# Altium schematic sheet main.SchDoc
size A3; SheetNumber: 1; SheetTotal: 4
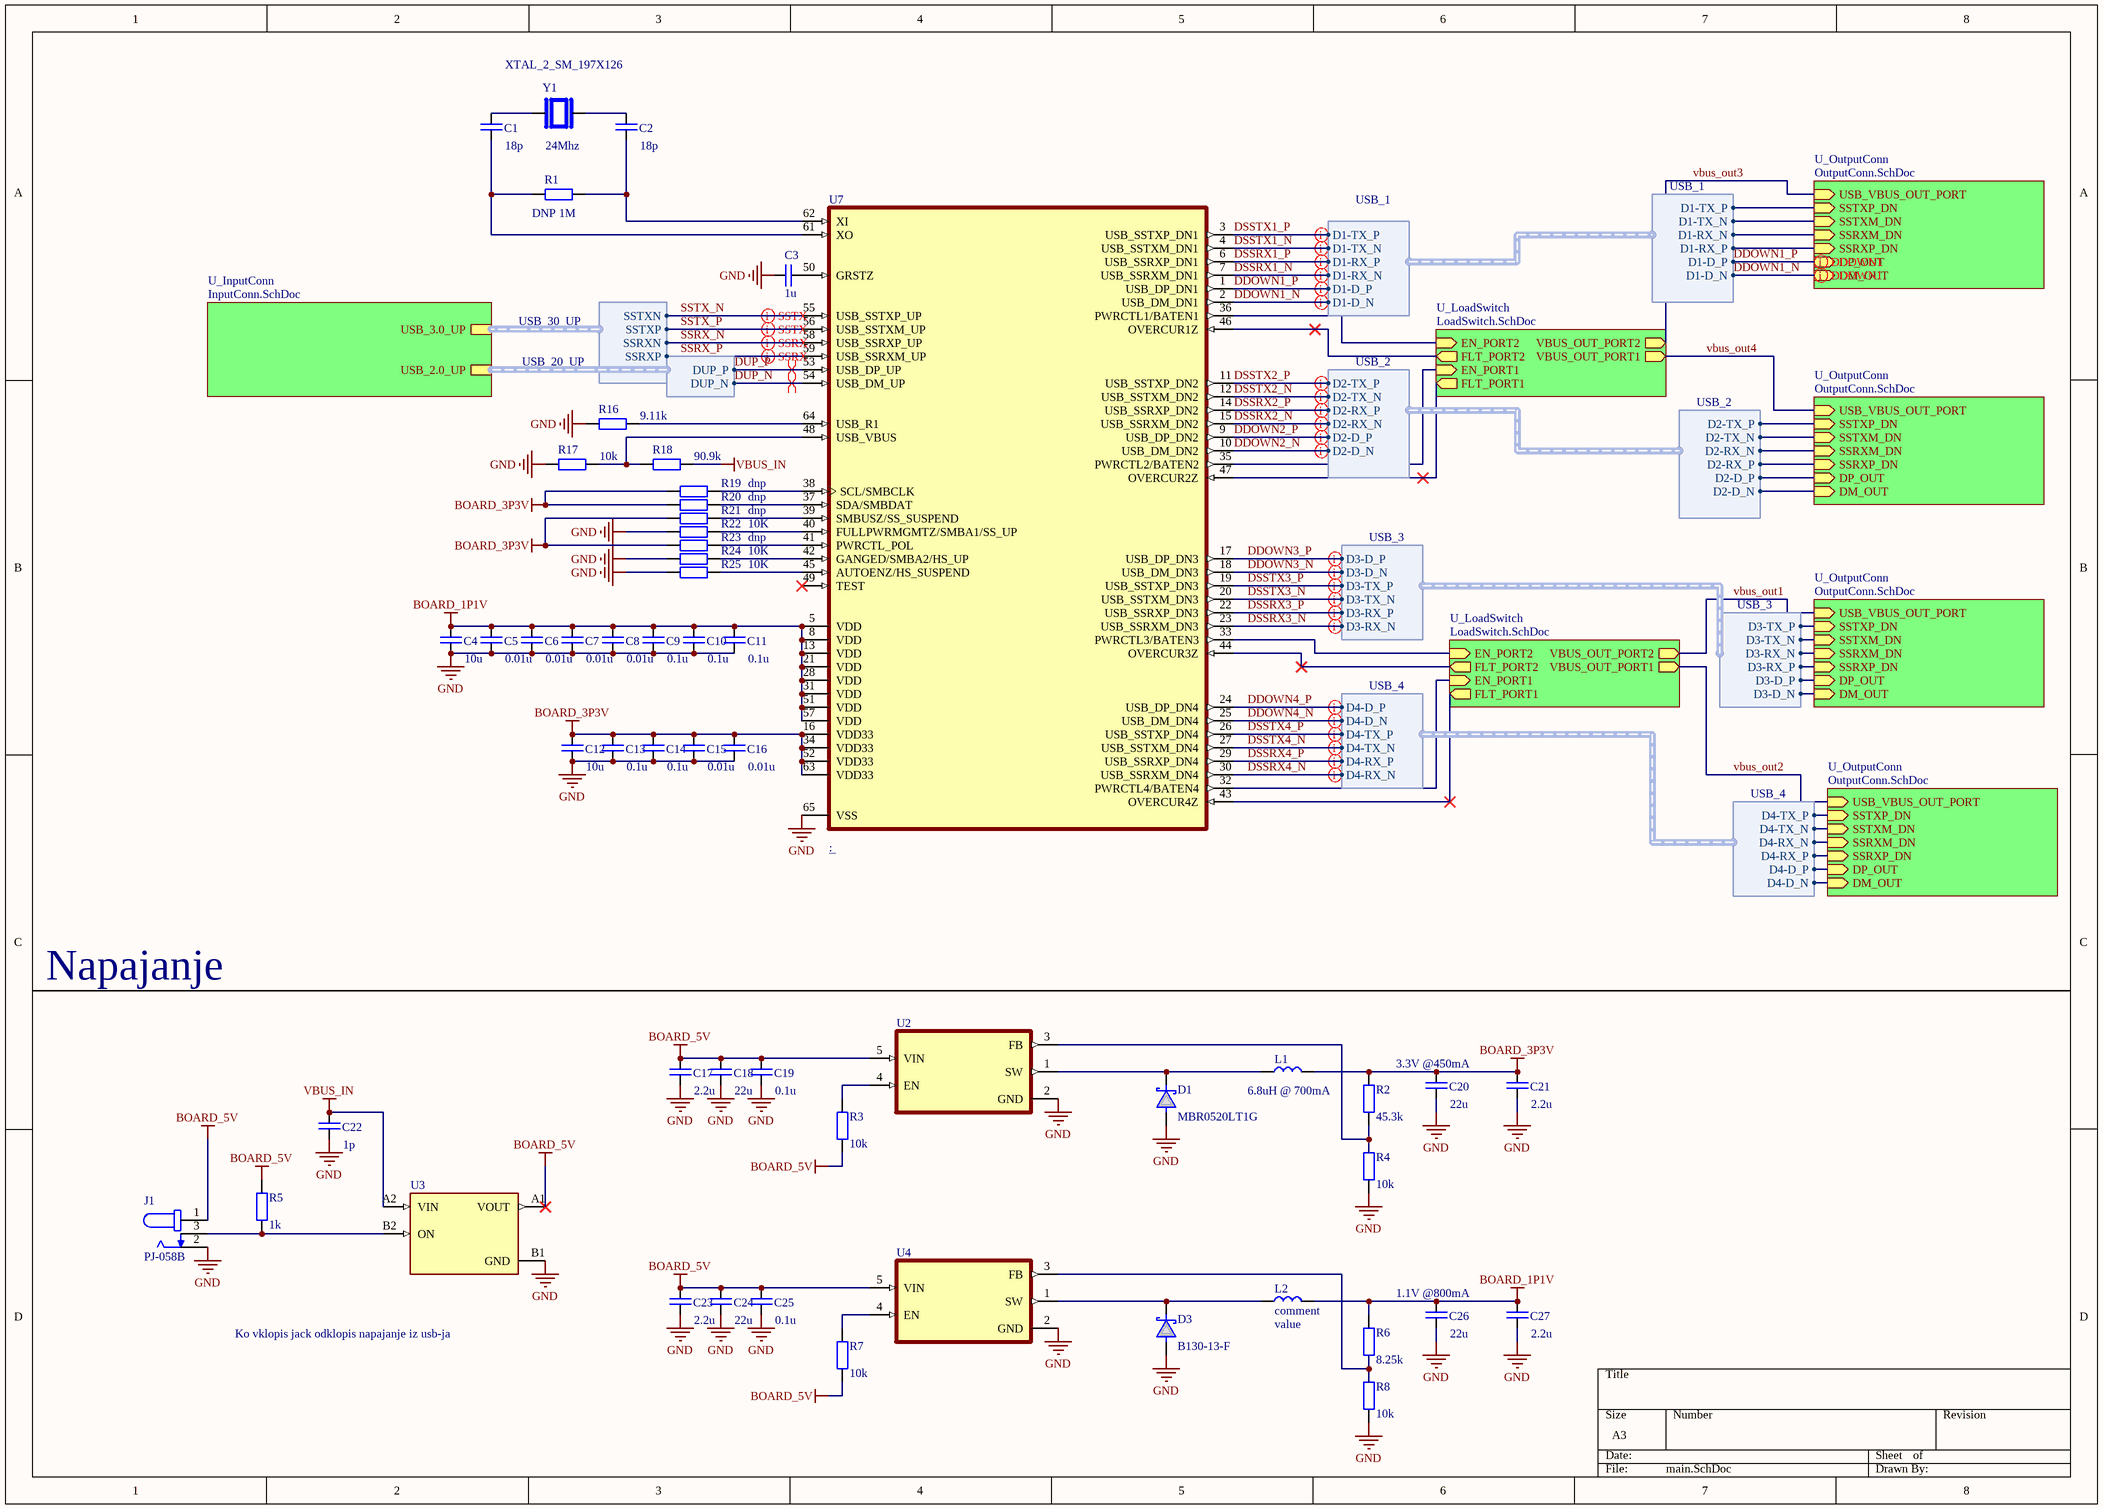
[diagram p0: main.SchDoc]

## Parts
C1  value 18p  [CAP_0603_N]  (hidden comment: comment)
C2  value 18p  [CAP_0603_N]  (hidden comment: comment)
C3  value 1u  [CAP_0603_N]  (hidden comment: comment)
C4  value 10u  [CAP_0603_N]  (hidden comment: comment)
C5  value 0.01u  [CAP_0603_N]  (hidden comment: comment)
C6  value 0.01u  [CAP_0603_N]  (hidden comment: comment)
C7  value 0.01u  [CAP_0603_N]  (hidden comment: comment)
C8  value 0.01u  [CAP_0603_N]  (hidden comment: comment)
C9  value 0.1u  [CAP_0603_N]  (hidden comment: comment)
C10  value 0.1u  [CAP_0603_N]  (hidden comment: comment)
C11  value 0.1u  [CAP_0603_N]  (hidden comment: comment)
C12  value 10u  [CAP_0603_N]  (hidden comment: comment)
C13  value 0.1u  [CAP_0603_N]  (hidden comment: comment)
C14  value 0.1u  [CAP_0603_N]  (hidden comment: comment)
C15  value 0.01u  [CAP_0603_N]  (hidden comment: comment)
C16  value 0.01u  [CAP_0603_N]  (hidden comment: comment)
C17  value 2.2u  [CAP_0603_N]  (hidden comment: comment)
C18  value 22u  [CAP_0603_N]  (hidden comment: comment)
C19  value 0.1u  [CAP_0603_N]  (hidden comment: comment)
C20  value 22u  [CAP_0603_N]  (hidden comment: comment)
C21  value 2.2u  [CAP_0603_N]  (hidden comment: comment)
C22  value 1p  [CAP_0603_N]  (hidden comment: comment)
C23  value 2.2u  [CAP_0603_N]  (hidden comment: comment)
C24  value 22u  [CAP_0603_N]  (hidden comment: comment)
C25  value 0.1u  [CAP_0603_N]  (hidden comment: comment)
C26  value 22u  [CAP_0603_N]  (hidden comment: comment)
C27  value 2.2u  [CAP_0603_N]  (hidden comment: comment)
D1  value MBR0520LT1G  [SOD-123_N]  (hidden comment: comment)
D3  value B130-13-F  [SOD-123_N]  (hidden comment: comment)
J1  PJ-058B  [CUI_PJ-058B]
L1  value 6.8uH @ 700mA  [SMD_1206_N]  (hidden comment: comment)
L2  comment  [SMD_0603_N]
R1  DNP  value 1M  [SMD_0603_N]
R2  value 45.3k  [SMD_0603_N]  (hidden comment: comment)
R3  value 10k  [SMD_0603_N]  (hidden comment: comment)
R4  value 10k  [SMD_0603_N]  (hidden comment: comment)
R5  value 1k  [SMD_0603_N]  (hidden comment: comment)
R6  value 8.25k  [SMD_0603_N]  (hidden comment: comment)
R7  value 10k  [SMD_0603_N]  (hidden comment: comment)
R8  value 10k  [SMD_0603_N]  (hidden comment: comment)
R16  value 9.11k  [SMD_0603_N]  (hidden comment: DNP)
R17  value 10k  [SMD_0603_N]  (hidden comment: DNP)
R18  value 90.9k  [SMD_0603_N]  (hidden comment: DNP)
R19  DNP  [SMD_0603_N]
R20  DNP  [SMD_0603_N]
R21  DNP  [SMD_0603_N]
R22  value 10K  [SMD_0603_N]  (hidden comment: DNP)
R23  DNP  [SMD_0603_N]
R24  value 10K  [SMD_0603_N]  (hidden comment: DNP)
R25  value 10K  [SMD_0603_N]  (hidden comment: DNP)
U2  (no value)  [SOT95P280X145-5N]
U3  (no value)  [BGA4N50P2X2_88X88X50N]
U4  (no value)  [SOT95P280X145-5N]
U7  (no value)  [QFN50P900X900X100-65N]
Y1  XTAL_2_SM_197X126  value 24Mhz  [XTAL_CC7V-T1A-32.768KHZ-12.5PF-100PPM-TA-QC]

## Sub-sheets
U_InputConn = InputConn.SchDoc: USB_2.0_UP (harness USB_20_UP), USB_3.0_UP (harness USB_30_UP)
U_LoadSwitch = LoadSwitch.SchDoc: EN_PORT2 (in), EN_PORT1 (in), VBUS_OUT_PORT2 (out), VBUS_OUT_PORT1 (out), FLT_PORT2 (out), FLT_PORT1 (out)
U_LoadSwitch = LoadSwitch.SchDoc: EN_PORT2 (in), EN_PORT1 (in), VBUS_OUT_PORT2 (out), VBUS_OUT_PORT1 (out), FLT_PORT2 (out), FLT_PORT1 (out)
U_OutputConn = OutputConn.SchDoc: USB_VBUS_OUT_PORT (in), SSTXP_DN (in), SSTXM_DN (in), SSRXM_DN (in), SSRXP_DN (in), DP_OUT (in), DM_OUT (in)
U_OutputConn = OutputConn.SchDoc: USB_VBUS_OUT_PORT (in), SSTXP_DN (in), SSTXM_DN (in), SSRXM_DN (in), SSRXP_DN (in), DP_OUT (in), DM_OUT (in)
U_OutputConn = OutputConn.SchDoc: USB_VBUS_OUT_PORT (in), SSTXP_DN (in), SSTXM_DN (in), SSRXM_DN (in), SSRXP_DN (in), DP_OUT (in), DM_OUT (in)
U_OutputConn = OutputConn.SchDoc: USB_VBUS_OUT_PORT (in), SSTXP_DN (in), SSTXM_DN (in), SSRXM_DN (in), SSRXP_DN (in), DP_OUT (in), DM_OUT (in)

## Harnesses
USB_20_UP: DUP_N, DUP_P
USB_30_UP: SSRXN, SSRXP, SSTXN, SSTXP
USB_1: D1-D_P, D1-D_N, D1-RX_P, D1-RX_N, D1-TX_P, D1-TX_N
USB_2: D2-D_P, D2-D_N, D2-RX_P, D2-RX_N, D2-TX_P, D2-TX_N
USB_3: D3-D_P, D3-D_N, D3-RX_P, D3-RX_N, D3-TX_P, D3-TX_N
USB_4: D4-D_P, D4-D_N, D4-RX_P, D4-RX_N, D4-TX_P, D4-TX_N

## Nets
BOARD_1P1V: C4.1 C5.1 C6.1 C7.1 C8.1 C9.1 C10.1 C11.1 C26.1 C27.1 L2.2 R6.1 U7.5(VDD) U7.8(VDD) U7.13(VDD) U7.21(VDD) U7.28(VDD) U7.31(VDD) U7.51(VDD) U7.57(VDD)
BOARD_3P3V: C12.1 C13.1 C14.1 C15.1 C16.1 C20.1 C21.1 L1.2 R2.1 R19.1 R20.1 R21.1 R23.1 U7.16(VDD33) U7.34(VDD33) U7.52(VDD33) U7.63(VDD33)
BOARD_5V: C17.1 C18.1 C19.1 C23.1 C24.1 C25.1 J1.1 R3.2 R5.1 R7.2 U2.5(VIN) U3.A1(VOUT) U4.5(VIN)
GND: C3.1 C4.2 C5.2 C6.2 C7.2 C8.2 C9.2 C10.2 C11.2 C12.2 C13.2 C14.2 C15.2 C16.2 C17.2 C18.2 C19.2 C20.2 C21.2 C22.2 C23.2 C24.2 C25.2 C26.2 C27.2 D1.A D3.A J1.2 R4.2 R8.2 R16.1 R17.1 R22.1 R24.1 R25.1 U2.2(GND) U3.B1(GND) U4.2(GND) U7.65(VSS)
VBUS_IN: C22.1 R18.2 U3.A2(VIN)
DDOWN1_N: U7.2(USB_DM_DN1) ; sheet U_OutputConn/DM_OUT, harness USB_1.D1-D_N
DDOWN1_P: U7.1(USB_DP_DN1) ; sheet U_OutputConn/DP_OUT, harness USB_1.D1-D_P
DDOWN2_N: U7.10(USB_DM_DN2) ; sheet U_OutputConn/DM_OUT, harness USB_2.D2-D_N
DDOWN2_P: U7.9(USB_DP_DN2) ; sheet U_OutputConn/DP_OUT, harness USB_2.D2-D_P
DDOWN3_N: U7.18(USB_DM_DN3) ; sheet U_OutputConn/DM_OUT, harness USB_3.D3-D_N
DDOWN3_P: U7.17(USB_DP_DN3) ; sheet U_OutputConn/DP_OUT, harness USB_3.D3-D_P
DDOWN4_N: U7.25(USB_DM_DN4) ; sheet U_OutputConn/DM_OUT, harness USB_4.D4-D_N
DDOWN4_P: U7.24(USB_DP_DN4) ; sheet U_OutputConn/DP_OUT, harness USB_4.D4-D_P
DSSRX1_N: U7.7(USB_SSRXM_DN1) ; sheet U_OutputConn/SSRXM_DN, harness USB_1.D1-RX_N
DSSRX1_P: U7.6(USB_SSRXP_DN1) ; sheet U_OutputConn/SSRXP_DN, harness USB_1.D1-RX_P
DSSRX2_N: U7.15(USB_SSRXM_DN2) ; sheet U_OutputConn/SSRXM_DN, harness USB_2.D2-RX_N
DSSRX2_P: U7.14(USB_SSRXP_DN2) ; sheet U_OutputConn/SSRXP_DN, harness USB_2.D2-RX_P
DSSRX3_N: U7.23(USB_SSRXM_DN3) ; sheet U_OutputConn/SSRXM_DN, harness USB_3.D3-RX_N
DSSRX3_P: U7.22(USB_SSRXP_DN3) ; sheet U_OutputConn/SSRXP_DN, harness USB_3.D3-RX_P
DSSRX4_N: U7.30(USB_SSRXM_DN4) ; sheet U_OutputConn/SSRXM_DN, harness USB_4.D4-RX_N
DSSRX4_P: U7.29(USB_SSRXP_DN4) ; sheet U_OutputConn/SSRXP_DN, harness USB_4.D4-RX_P
DSSTX1_N: U7.4(USB_SSTXM_DN1) ; sheet U_OutputConn/SSTXM_DN, harness USB_1.D1-TX_N
DSSTX1_P: U7.3(USB_SSTXP_DN1) ; sheet U_OutputConn/SSTXP_DN, harness USB_1.D1-TX_P
DSSTX2_N: U7.12(USB_SSTXM_DN2) ; sheet U_OutputConn/SSTXM_DN, harness USB_2.D2-TX_N
DSSTX2_P: U7.11(USB_SSTXP_DN2) ; sheet U_OutputConn/SSTXP_DN, harness USB_2.D2-TX_P
DSSTX3_N: U7.20(USB_SSTXM_DN3) ; sheet U_OutputConn/SSTXM_DN, harness USB_3.D3-TX_N
DSSTX3_P: U7.19(USB_SSTXP_DN3) ; sheet U_OutputConn/SSTXP_DN, harness USB_3.D3-TX_P
DSSTX4_N: U7.27(USB_SSTXM_DN4) ; sheet U_OutputConn/SSTXM_DN, harness USB_4.D4-TX_N
DSSTX4_P: U7.26(USB_SSTXP_DN4) ; sheet U_OutputConn/SSTXP_DN, harness USB_4.D4-TX_P
DUP_N: U7.54(USB_DM_UP) ; sheet U_InputConn/USB_2.0_UP.DUP_N
DUP_P: U7.53(USB_DP_UP) ; sheet U_InputConn/USB_2.0_UP.DUP_P
SSRX_N: U7.58(USB_SSRXP_UP) ; sheet U_InputConn/USB_3.0_UP.SSRXN
SSRX_P: U7.59(USB_SSRXM_UP) ; sheet U_InputConn/USB_3.0_UP.SSRXP
SSTX_N: U7.55(USB_SSTXP_UP) ; sheet U_InputConn/USB_3.0_UP.SSTXN
SSTX_P: U7.56(USB_SSTXM_UP) ; sheet U_InputConn/USB_3.0_UP.SSTXP
vbus_out1: sheet U_LoadSwitch/VBUS_OUT_PORT2, sheet U_OutputConn/USB_VBUS_OUT_PORT
vbus_out2: sheet U_LoadSwitch/VBUS_OUT_PORT1, sheet U_OutputConn/USB_VBUS_OUT_PORT
vbus_out3: sheet U_LoadSwitch/VBUS_OUT_PORT2, sheet U_OutputConn/USB_VBUS_OUT_PORT
vbus_out4: sheet U_LoadSwitch/VBUS_OUT_PORT1, sheet U_OutputConn/USB_VBUS_OUT_PORT
NetC1_1: C1.1 Y1.1
NetC1_2: C1.2 R1.1 U7.61(XO)
NetC2_1: C2.1 Y1.2
NetC2_2: C2.2 R1.2 U7.62(XI)
NetC3_2: C3.2 U7.50(GRSTZ)
NetD1_C: D1.C L1.1 U2.1(SW)
NetD3_C: D3.C L2.1 U4.1(SW)
NetJ1_3: J1.3 R5.2 U3.B2(ON)
NetR2_2: R2.2 R4.1 U2.3(FB)
NetR3_1: R3.1 U2.4(EN)
NetR6_2: R6.2 R8.1 U4.3(FB)
NetR7_1: R7.1 U4.4(EN)
NetR16_2: R16.2 U7.64(USB_R1)
NetR17_2: R17.2 R18.1 U7.48(USB_VBUS)
NetR19_2: R19.2 U7.38(SCL/SMBCLK)
NetR20_2: R20.2 U7.37(SDA/SMBDAT)
NetR21_2: R21.2 U7.39(SMBUSZ/SS_SUSPEND)
NetR22_2: R22.2 U7.40(FULLPWRMGMTZ/SMBA1/SS_UP)
NetR23_2: R23.2 U7.41(PWRCTL_POL)
NetR24_2: R24.2 U7.42(GANGED/SMBA2/HS_UP)
NetR25_2: R25.2 U7.45(AUTOENZ/HS_SUSPEND)
NetU7_32: U7.32(PWRCTL4/BATEN4) ; sheet U_LoadSwitch/EN_PORT1
NetU7_33: U7.33(PWRCTL3/BATEN3) ; sheet U_LoadSwitch/EN_PORT2
NetU7_35: U7.35(PWRCTL2/BATEN2) ; sheet U_LoadSwitch/EN_PORT1
NetU7_36: U7.36(PWRCTL1/BATEN1) ; sheet U_LoadSwitch/EN_PORT2
NetU7_43: U7.43(OVERCUR4Z) ; sheet U_LoadSwitch/FLT_PORT1
NetU7_44: U7.44(OVERCUR3Z) ; sheet U_LoadSwitch/FLT_PORT2
NetU7_46: U7.46(OVERCUR1Z) ; sheet U_LoadSwitch/FLT_PORT2
NetU7_47: U7.47(OVERCUR2Z) ; sheet U_LoadSwitch/FLT_PORT1

Not connected (* = marked no-connect by the designer): U7 49(TEST)*

## Layout directives
differential pair: DDOWN1_N, DDOWN1_P, DDOWN2_N, DDOWN2_P, DDOWN3_N, DDOWN3_P, DDOWN4_N, DDOWN4_P, DSSRX1_N, DSSRX1_P, DSSRX2_N, DSSRX2_P, DSSRX3_N, DSSRX3_P, DSSRX4_N, DSSRX4_P, DSSTX1_N, DSSTX1_P, DSSTX2_N, DSSTX2_P, DSSTX3_N, DSSTX3_P, DSSTX4_N, DSSTX4_P, DUP_N, DUP_P, SSRX_N, SSRX_P, SSTX_N, SSTX_P

## Notes on the sheet
- Napajanje
- (near C20) 3.3V @450mA
- (near C26) 1.1V @800mA
- Ko vklopis jack odklopis napajanje iz usb-ja

## Library data of the parts
C1-C27 = Capacitor non-polarized
D1 D3 = Diode Schottky
J1 = PJ-058B: 2.5 mm Center Pin, 2.5 A, Right Angle, Through Hole, Locking Type, Dc Power Jack Connector; MP: PJ-058B; Package: None; Price: None; Availability: Unavailable; Value: *
L1 L2 = Inductor
  L2: Value: value
R1-R8 R16-R25 = Resistor
  R19-R21 R23: Value: dnp
U2 U4 = LMR10510XMFX/NOPB: Package: None; Price: None; Value: *; MP: LMR10510XMFX/NOPB; Availability: Unavailable
U3 = TPS22910AYZVR: 5.5V, 2A, 61m? Active-Low Load Switch With Reverse Current Protection; Price: None; Package: None; Availability: Unavailable; MP: TPS22910AYZVR; Value: *
U7 = TUSB8041RGCR: 4-port 5-Gbps SuperSpeed USB 3.0 hub 64-VQFN 0 to 70; MF: Texas Instruments; Texas_Instruments-Purchase-URL: https://snapeda.com/shop?store=Texas+Instruments&id=104660; Arrow_Electronics-Purchase-URL: https://snapeda.com/shop?store=Arrow+Electronics&id=104660; Package: VQFN-64 Texas Instruments; Value: *; SnapEDA_Link: https://www.snapeda.com/parts/TUSB8041RGCR/Texas%20Instruments/view-part/104660/?ref=snap; Price: None; MP: TUSB8041RGCR; Mouser-Purchase-URL: https://snapeda.com/shop?store=Mouser&id=104660; Availability: Good
Y1 = CC7V-T1A-32.768KHZ-12.5PF-100PPM-TA-QC: LOW FREQUENCY CRYSTAL; MF: Micro Crystal AG; Package: SMD-2 Micro Crystal; Price: None; Check_prices: https://www.snapeda.com/parts/CC7V-T1A-32.768KHZ-12.5PF-100PPM-TA-QC/Micro+Crystal/view-part/?ref=eda; SnapEDA_Link: https://www.snapeda.com/parts/CC7V-T1A-32.768KHZ-12.5PF-100PPM-TA-QC/Micro+Crystal/view-part/?ref=snap; MP: CC7V-T1A-32.768KHZ-12.5PF-100PPM-TA-QC; Availability: In Stock; Purchase-URL: https://pricing.snapeda.com/search/part/CC7V-T1A-32.768KHZ-12.5PF-100PPM-TA-QC/?ref=eda